# Altium schematic sheet 05_dac.SchDoc: KART : DAC
size A4; DrawnBy: JNieto; DocumentNumber: 4; Revision: 1.0; SheetNumber: 8; SheetTotal: 10; Version: V 1.0.0
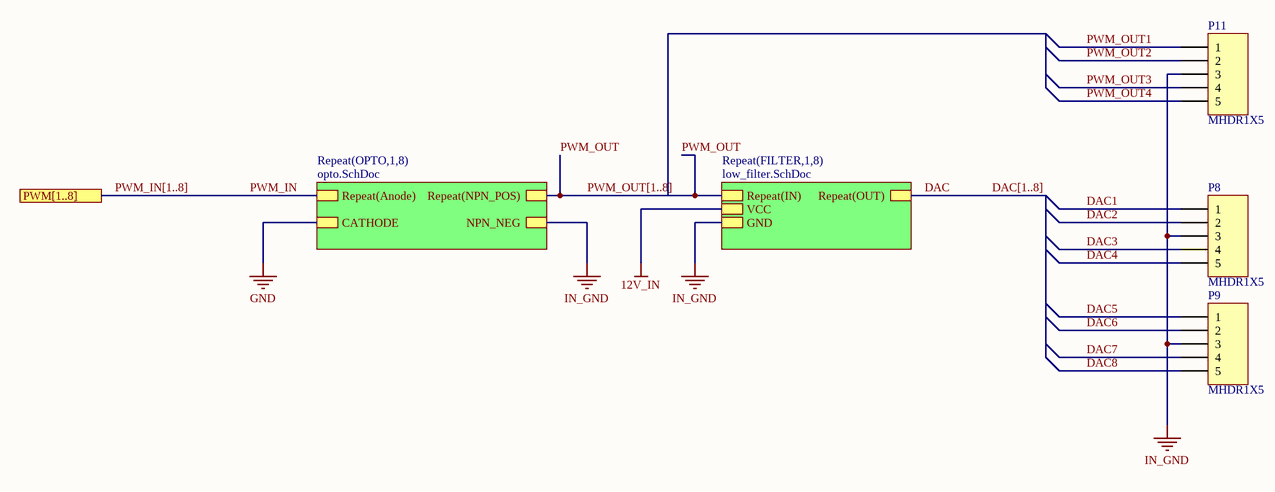
[diagram p0: 05_dac.SchDoc]

## Parts
P8  MHDR1X5  [MHDR1X5]
P9  MHDR1X5  [MHDR1X5]
P11  MHDR1X5  [MHDR1X5]

## Sub-sheets
Repeat(FILTER,1,8) = low_filter.SchDoc: VCC, GND, Repeat(IN), Repeat(OUT)
Repeat(OPTO,1,8) = opto.SchDoc: NPN_NEG, Repeat(NPN_POS), CATHODE, Repeat(Anode)

## Ports
PWM[1..8]

## Nets
12V_IN: sheet Repeat(FILTER,1,8)/VCC
GND: sheet Repeat(OPTO,1,8)/CATHODE
IN_GND: P8.3 P9.3 P11.3 ; sheet Repeat(OPTO,1,8)/NPN_NEG, sheet Repeat(FILTER,1,8)/GND
DAC: sheet Repeat(FILTER,1,8)/Repeat(OUT)
DAC1: P8.1
DAC2: P8.2
DAC3: P8.4
DAC4: P8.5
DAC5: P9.1
DAC6: P9.2
DAC7: P9.4
DAC8: P9.5
PWM_IN: sheet Repeat(OPTO,1,8)/Repeat(Anode)
PWM_OUT: sheet Repeat(OPTO,1,8)/Repeat(NPN_POS), sheet Repeat(FILTER,1,8)/Repeat(IN)  [also labelled PWM_OUT[1..8]]
PWM_OUT1: P11.1
PWM_OUT2: P11.2
PWM_OUT3: P11.4
PWM_OUT4: P11.5

## Buses and harness runs
bus DAC[1..8]
bus PWM_IN[1..8] = port PWM[1..8]

## Library data of the parts
P8 P9 P11 = MHDR1X5: Header, 5-Pin; LatestRevisionDate: 17-Jul-2002; LatestRevisionNote: Re-released for DXP Platform.; Publisher: Altium Limited